# Altium schematic sheet RaceDAQ_POWER.SchDoc
size A4; SheetNumber: 1; SheetTotal: 4
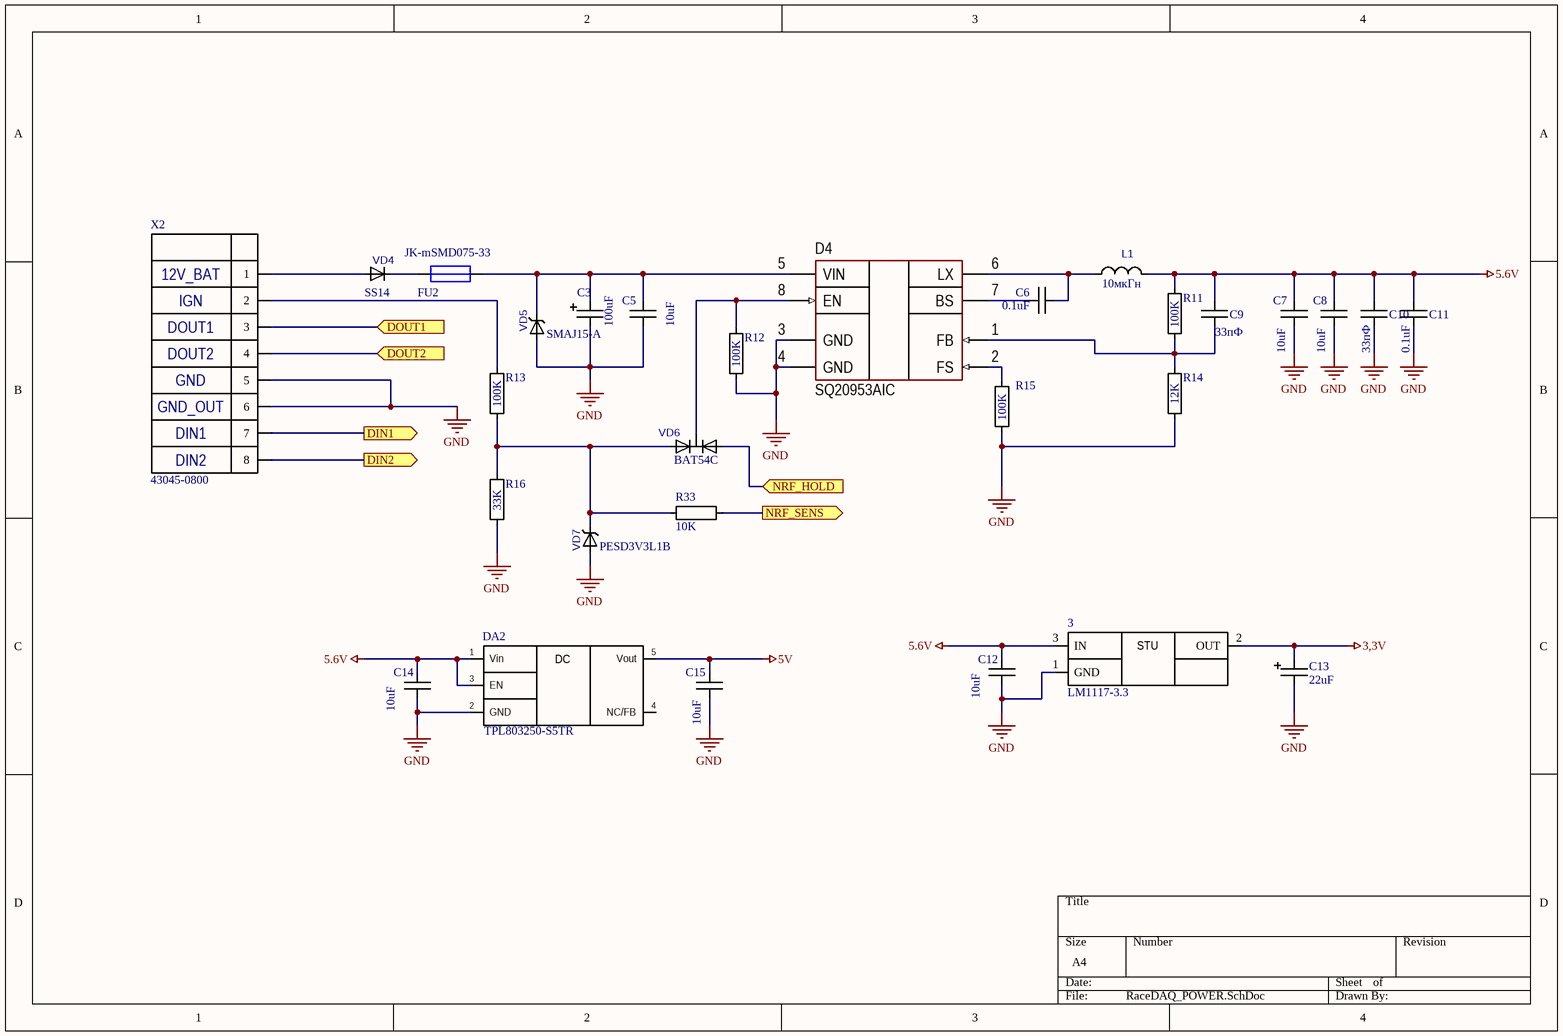
[diagram p0: RaceDAQ_POWER.SchDoc]

## Parts
3  LM1117-3.3  [SOT230P700X180-4L40N]
C3  100uF  [CAPPRD250W50D680H1250]
C5  10uF  [CAPC3216X130L50N]
C6  0.1uF  [CAPC1608X90L25N]
C7  10uF  [CAPC3216X130L50N]
C8  10uF  [CAPC3216X130L50N]
C9  33пФ  [CAPC1608X90L25N]
C10  33пФ  [CAPC1608X90L25N]
C11  0.1uF  [CAPC1608X90L25N]
C12  10uF  [CAPC3216X130L50N]
C13  22uF  [CAPPM3216X180]
C14  10uF  [CAPC3216X130L50N]
C15  10uF  [CAPC3216X130L50N]
D4  (no value)  [8-SOT]
DA2  TPL803250-S5TR  [SOT95P280X145-5L30N]
FU2  JK-mSMD075-33  [FUSE: 1812]
L1  10мкГн  [MPH0630]
R11  100K  [RESC1608X55L25N]
R12  100K  [RESC1608X55L25N]
R13  100K  [RESC1608X55L25N]
R14  12K  [RESC1608X55L25N]
R15  100K  [RESC1608X55L25N]
R16  33K  [RESC1608X55L25N]
R33  10K  [RESC2012X60L35N]
VD4  SS14  [DIOM5436X247N]
VD5  SMAJ15-A  [DIOM5126X229]
VD6  BAT54C  [SOT95P240X110-3L16]
VD7  PESD3V3L1B  [SODFL1608X65N]
X2  43045-0800  [43045-0800]

## Ports
DIN1 (out), DIN2 (out), DOUT1 (in), DOUT2 (in), NRF_HOLD (in), NRF_SENS (out)

## Nets
3,3V: 3.2(OUT) C13.1
5.6V: 3.3(IN) C7.1 C8.1 C9.1 C10.1 C11.1 C12.1 C14.1 DA2.1(Vin) DA2.3(EN) L1.2 R11.1
5V: C15.1 DA2.5(Vout)
GND: 3.1(GND) C3.2 C5.2 C7.2 C8.2 C10.2 C11.2 C12.2 C13.2 C14.2 C15.2 D4.3(GND) D4.4(GND) DA2.2(GND) R12.2 R14.2 R15.2 R16.2 VD5.A VD7.A X2.5 X2.6
DIN1: X2.7 ; port DIN1
DIN2: X2.8 ; port DIN2
DOUT1: X2.3 ; port DOUT1
DOUT2: X2.4 ; port DOUT2
NRF_HOLD: VD6.2 ; port NRF_HOLD
NRF_SENS: R33.1 ; port NRF_SENS
NetC3_1: C3.1 C5.1 D4.5(VIN) FU2.2 VD5.C
NetC6_1: C6.1 D4.7(BS)
NetC6_2: C6.2 D4.6(LX) L1.1
NetC9_2: C9.2 D4.1(FB) R11.2 R14.1
NetD4_2: D4.2(FS) R15.1
NetD4_8: D4.8(EN) R12.1 VD6.3
NetFU2_1: FU2.1 VD4.C
NetR13_1: R13.1 X2.2
NetR13_2: R13.2 R16.1 R33.2 VD6.1 VD7.C
NetVD4_A: VD4.A X2.1

Not connected (* = marked no-connect by the designer): DA2 4(NC/FB)

## Notes on the sheet
- (near X2) 12V_BAT
- (near X2) IGN
- (near X2) DOUT1
- (near X2) DOUT2
- (near X2) GND
- (near X2) GND_OUT
- (near X2) DIN1
- (near X2) DIN2
- (in symbol LM1117-3.3) STU
- (in symbol TPS763xx) DC

## Library data of the parts
C3 = Radial 6.3x11: PartNumber: EEUFR1E101; Voltage: 25V; Type: Radial 6.3x11; Value: 100uF
C5 C7 C8 C12 C14 C15 = C1206: PartNumber: GRM31CR61E106KA12L; Type: C1206; Voltage: 25V; Value: 10uF
C6 C11 = C0603: PartNumber: CL10B104KB8NNNC; Type: C0603; Voltage: 50V; Value: 0.1uF
C9 C10 = C0603: PartNumber: CL10C330JB8NNNC,; Type: C0603; Voltage: 50V; Value: 33пФ
C13 = CASEA: PartNumber: 293D226X9010A2TE3; Type: CASEA; Value: 22uF
D4 = SQ20953AIC: Buck converter; Manufacturer: Silergy; ValueManufacturerPartNumber: DC/DC buck converter, input 4...60V, 2.1MHz, output 0.765...55V, 0.6A, -40...+125°C, SOT23-8; VoltageInput: input 4...60V; Frequency: 2.1MHz; CurrentOutput: 0.6A; VoltageOutput: output 0.765...55V; HelpURL: https://www.chipdip.ru/product/sq20953aic-silergy-8027122657; Package: SOT23-8; ComponentType: DC/DC buck converter; Temperature: -40...+125°C; PartNumber: SQ20953AIC
DA2 = TPS763xx: Type: TPL803225-S5TR-S; Value: TPL803250-S5TR
FU2 = JK-mSMD075-33: Предохраниетель ток срабатывания 1,5А, ток удержания 750мА; Manuf: JINRUI; Current: 1.5A
L1 = MPH0630: PartNumber: MWSA0603S-100MT; Type: MPH0630; Value: 10мкГн
R11-R13 R15 = R0603: PartNumber: RC0603FR-07100KL; Type: R0603; Value: 100K
R14 = R0603: PartNumber: RC0603FR-0712KL; Type: R0603; Value: 12K
R16 = R0603: PartNumber: RC0603FR-0733KL; Type: R0603; Value: 33K
R33 = R0805: Type: R0805; Value: 10K
VD4 = SS26T3G: Type: SS26T3G; Value: SS14
VD5 = SMAJ-A: Type: SMAJ-A; Value: SMAJ15-A
VD6 = BAT54: Type: BAT54; Value: BAT54C
VD7 = PESDxS1UB: Type: PESDxS1UB; Value: PESD3V3L1B
3 = LM1117-3.3: Type: LM1117-3.3; Value: LM1117-3.3
X2 = 43045-0800: Type: 43045-0800; Value: 43045-0800